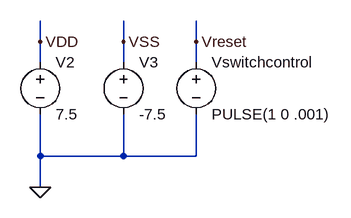
[diagram p0: schematic ns.asc]
ns.asc, the LTspice schematic file:
Version 4
SHEET 1 1520 1008
WIRE 1072 768 1072 736
WIRE 1200 768 1200 736
WIRE 1312 768 1312 736
WIRE 1072 800 1072 768
WIRE 1200 800 1200 768
WIRE 1312 800 1312 768
WIRE 1072 944 1072 880
WIRE 1200 944 1200 880
WIRE 1200 944 1072 944
WIRE 1312 944 1312 880
WIRE 1312 944 1200 944
WIRE 1072 992 1072 944
FLAG 1072 768 VDD
FLAG 1200 768 VSS
FLAG 1312 768 Vreset
FLAG 1072 992 0
SYMBOL voltage 1072 784 R0
SYMATTR InstName V2
SYMATTR Value 7.5
SYMBOL voltage 1200 784 R0
SYMATTR InstName V3
SYMATTR Value -7.5
SYMBOL voltage 1312 784 R0
SYMATTR InstName Vswitchcontrol
SYMATTR Value PULSE(1 0 .001)

The netlist it stands for:
* ns.asc
V2 VDD 0 7.5
V3 VSS 0 -7.5
Vswitchcontrol Vreset 0 PULSE(1 0 .001)
.backanno
.end